# EAGLE design Magnetorquer Board (EAGLE 8.3.2)
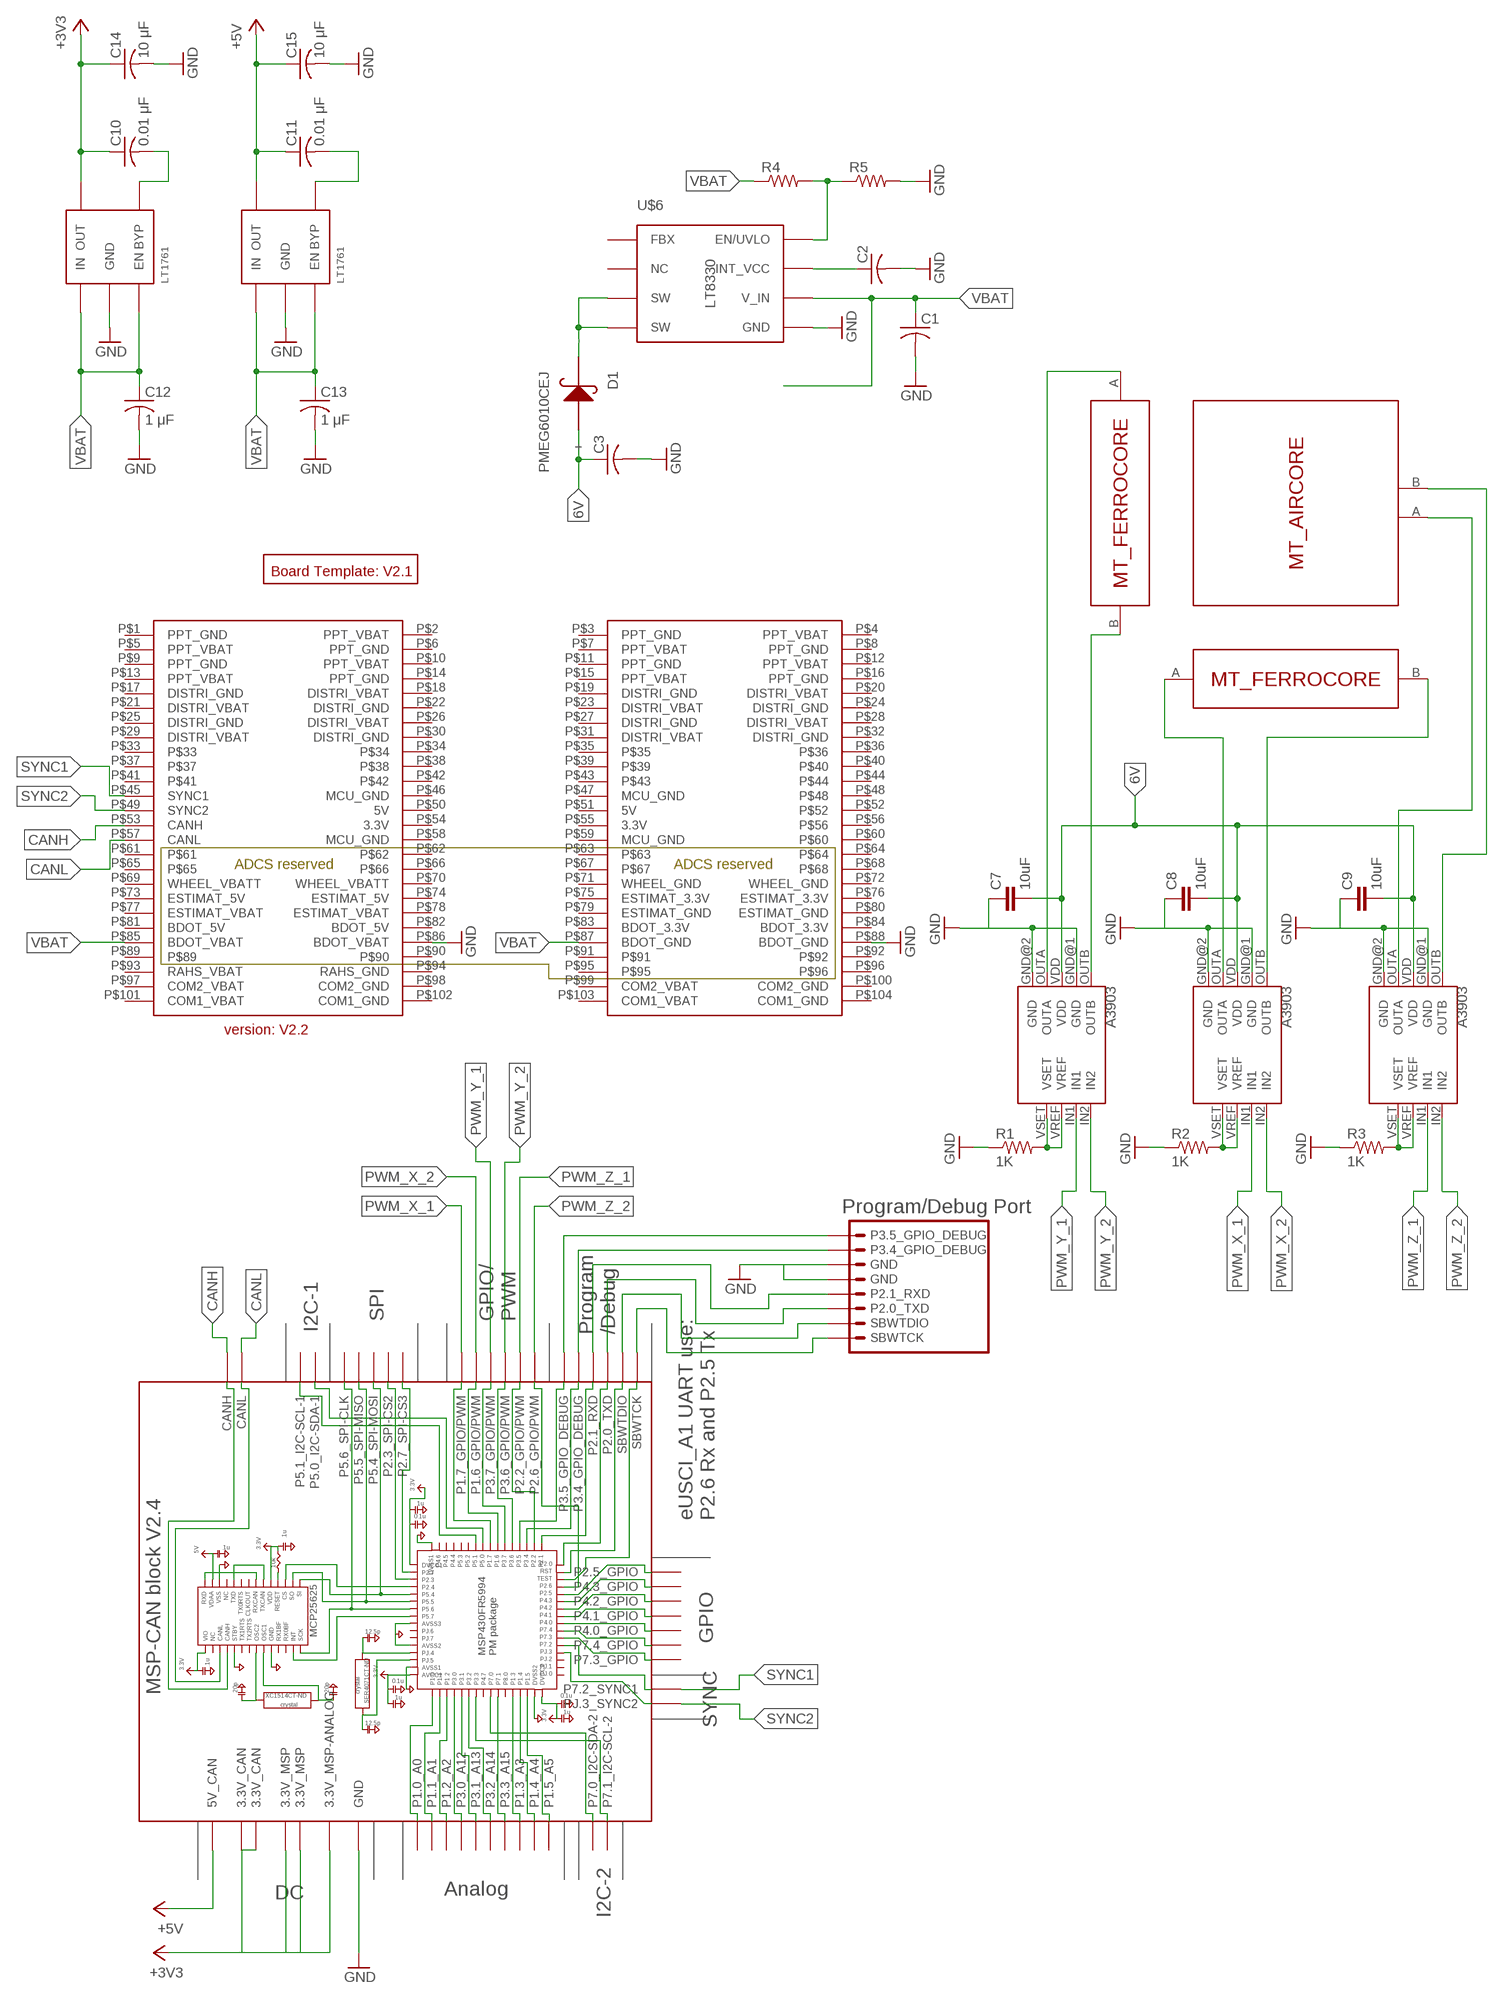
[diagram p0: schematic, sheet 1]

## Parts
C1  C-USC0805  [C0805]
C2  C-USC0805  [C0805]
C3  C-USC0805  [C0805]
C7  10uF  C-EUC0805  [C0805]
C8  10uF  C-EUC0805  [C0805]
C9  10uF  C-EUC0805  [C0805]
C10  0.01 μF  C-USC0805  [C0805]
C11  0.01 μF  C-USC0805  [C0805]
C12  1 μF  C-USC0805  [C0805]
C13  1 μF  C-USC0805  [C0805]
C14  10 μF  C-USC0805  [C0805]
C15  10 μF  C-USC0805  [C0805]
D1  PMEG6010CEJ  [SC-90]
LDO_3V3  LINEAR_LDO_LT1761-X  [SOT-23-5]
LDO_5V  LINEAR_LDO_LT1761-X  [SOT-23-5]
R1  1K  R-US_R0603  [R0603]
R2  1K  R-US_R0603  [R0603]
R3  1K  R-US_R0603  [R0603]
R4  R-US_R0805  [R0805]
R5  R-US_R0805  [R0805]
U1  A3903  [DFN-8EE]
U2  A3903  [DFN-8EE]
U3  A3903  [DFN-8EE]
U$1  PC104_CONNECTOR  [PC104_CONNECTOR]
U$2  BOARD_TEMPLATE  [BOARD_TEMPLATE]
U$3  MT_AIRCORE  [MT_AIRCORE]
U$4  MT_FERROCORE  [MT_FERROCORE]
U$5  MT_FERROCORE  [MT_FERROCORE]
U$6  LT8330  [DDB]
U$7  MSP-CAN_BLOCK  [MSP-CAN_BLOCK]
U$8  PROGRAM/DEBUG_PORT  [1X08_CONNECTOR]

## Nets
6V: C3.1 C7.2 C8.2 C9.2 D1.P$1(+) U1.VDD U2.VDD U3.VDD
+3V3: C10.1 C14.1 LDO_3V3.P$5(OUT) U$7.3.3V@CAN1(3.3V_CAN) U$7.3.3V@CAN2(3.3V_CAN) U$7.3.3V@MSP1(3.3V_MSP) U$7.3.3V@MSP2(3.3V_MSP) U$7.3.3V_ANALOG@MSP2(3.3V_MSP-ANALOG)
+5V: C11.1 C15.1 LDO_5V.P$5(OUT) U$7.5V(5V_CAN)
CANH: U$1.P$53(CANH) U$7.CANH
CANL: U$1.P$57(CANL) U$7.CANL
GND: C1.2 C2.2 C3.2 C7.1 C8.1 C9.1 C12.2 C13.2 C14.2 C15.2 LDO_3V3.P$2(GND) LDO_5V.P$2(GND) R1.1 R2.1 R3.1 R5.2 U1.GND@1(GND) U1.GND@2(GND) U2.GND@1(GND) U2.GND@2(GND) U3.GND@1(GND) U3.GND@2(GND) U$1.P$86(BDOT_VBAT) U$1.P$88(BDOT_GND) U$6.GND U$6.P$5(GND) U$7.GND@1(GND) U$7.GND@2(GND) U$7.GND@3(GND) U$7.GND@4(GND) U$7.GND@5(GND) U$7.GND@7(GND) U$7.GND@8(GND) U$7.GND@9(GND) U$7.GND@10(GND) U$7.GND@11(GND) U$7.GND@12(GND) U$7.GND@13(GND) U$7.GND@14(GND) U$7.GND@15(GND) U$7.GND@16(GND) U$7.GND@17(GND) U$7.GND@26(GND) U$8.5(GND) U$8.6(GND)
N$1: R1.2 U1.VREF U1.VSET
N$2: R2.2 U2.VREF U2.VSET
N$3: D1.P$2(-) U$6.P$3(SW) U$6.P$4(SW)
N$4: C2.1 U$6.P$7(INT_VCC)
N$5: R4.2 R5.1 U$6.P$8(EN/UVLO)
N$7: R3.2 U3.VREF U3.VSET
N$10: U1.OUTB U$4.B
N$11: U1.OUTA U$4.A
N$12: U2.OUTA U$5.A
N$13: U2.OUTB U$5.B
N$14: U3.OUTB U$3.B
N$15: U3.OUTA U$3.A
N$26: C10.2 LDO_3V3.P$4(BYP)
N$27: U$7.SBWTCK U$8.SBWTCK
N$28: U$7.SBWTDIO U$8.2(SBWTDIO)
N$29: U$7.P2.0_TXD U$8.3(P2.0_TXD)
N$30: U$7.P2.1_RXD U$8.4(P2.1_RXD)
N$31: U$7.P3.4_GPIO_DEBUG U$8.7(P3.4_GPIO_DEBUG)
N$32: U$7.P3.5_GPIO_DEBUG U$8.8(P3.5_GPIO_DEBUG)
N$33: C11.2 LDO_5V.P$4(BYP)
PWM_X_1: U2.IN1 U$7.P1.7_GPIO/PWM
PWM_X_2: U2.IN2 U$7.P1.6_GPIO/PWM
PWM_Y_1: U1.IN1 U$7.P3.7_GPIO/PWM
PWM_Y_2: U1.IN2 U$7.P3.6_GPIO/PWM
PWM_Z_1: U3.IN1 U$7.P2.2_GPIO/PWM
PWM_Z_2: U3.IN2 U$7.P2.6_GPIO/PWM
SYNC1: U$1.P$45(SYNC1) U$7.P7.2_SYNC1
SYNC2: U$1.P$49(SYNC2) U$7.PJ.3_SYNC2
VBAT: C1.1 C12.1 C13.1 LDO_3V3.P$1(IN) LDO_3V3.P$3(EN) LDO_5V.P$1(IN) LDO_5V.P$3(EN) R4.1 U$1.P$85(BDOT_VBAT) U$1.P$87(BDOT_GND) U$6.P$6(V_IN)
Unconnected: U$1.P$1(PPT_GND) U$1.P$2(PPT_VBAT) U$1.P$3(PPT_GND) U$1.P$4(PPT_VBAT) U$1.P$5(PPT_VBAT) U$1.P$6(PPT_GND) U$1.P$7(PPT_VBAT) U$1.P$8(PPT_GND) U$1.P$9(PPT_GND) U$1.P$10(PPT_VBAT) U$1.P$11(PPT_GND) U$1.P$12(PPT_VBAT) U$1.P$13(PPT_VBAT) U$1.P$14(PPT_GND) U$1.P$15(PPT_VBAT) U$1.P$16(PPT_GND) U$1.P$17(DISTRI_GND) U$1.P$18(DISTRI_VBAT) U$1.P$19(DISTRI_GND) U$1.P$20(DISTRI_VBAT) U$1.P$21(DISTRI_VBAT) U$1.P$22(DISTRI_GND) U$1.P$23(DISTRI_VBAT) U$1.P$24(DISTRI_GND) U$1.P$25(DISTRI_GND) U$1.P$26(DISTRI_VBAT) U$1.P$27(DISTRI_GND) U$1.P$28(DISTRI_VBAT) U$1.P$29(DISTRI_VBAT) U$1.P$30(DISTRI_GND) U$1.P$31(DISTRI_VBAT) U$1.P$32(DISTRI_GND) U$1.P$33 U$1.P$34 U$1.P$35 U$1.P$36 U$1.P$37 U$1.P$38 U$1.P$39 U$1.P$40 U$1.P$41 U$1.P$42 U$1.P$43 U$1.P$44 U$1.P$46(MCU_GND) U$1.P$47(MCU_GND) U$1.P$48 U$1.P$50(5V) U$1.P$51(5V) U$1.P$52 U$1.P$54(3.3V) U$1.P$55(3.3V) U$1.P$56 U$1.P$58(MCU_GND) U$1.P$59(MCU_GND) U$1.P$60 U$1.P$61 U$1.P$62 U$1.P$63 U$1.P$64 U$1.P$65 U$1.P$66 U$1.P$67 U$1.P$68 U$1.P$69(WHEEL_VBATT) U$1.P$70(WHEEL_VBATT) U$1.P$71(WHEEL_GND) U$1.P$72(WHEEL_GND) U$1.P$73(ESTIMAT_5V) U$1.P$74(ESTIMAT_5V) U$1.P$75(ESTIMAT_3.3V) U$1.P$76(ESTIMAT_3.3V) U$1.P$77(ESTIMAT_VBAT) U$1.P$78(ESTIMAT_VBAT) U$1.P$79(ESTIMAT_GND) U$1.P$80(ESTIMAT_GND) U$1.P$81(BDOT_5V) U$1.P$82(BDOT_5V) U$1.P$83(BDOT_3.3V) U$1.P$84(BDOT_3.3V) U$1.P$89 U$1.P$90 U$1.P$91 U$1.P$92 U$1.P$93(RAHS_VBAT) U$1.P$94(RAHS_GND) U$1.P$95 U$1.P$96 U$1.P$97(COM2_VBAT) U$1.P$98(COM2_GND) U$1.P$99(COM2_VBAT) U$1.P$100(COM2_GND) U$1.P$101(COM1_VBAT) U$1.P$102(COM1_GND) U$1.P$103(COM1_VBAT) U$1.P$104(COM1_GND) U$6.P$1(FBX) U$6.P$2(NC) U$7.P1.0_A0 U$7.P1.1_A1 U$7.P1.2_A2 U$7.P1.3_A3 U$7.P1.4_A4 U$7.P1.5_A5 U$7.P2.4_SPI-CS2(P2.3_SPI-CS2) U$7.P2.5_GPIO U$7.P2.7_SPI-CS3 U$7.P3.0_A12 U$7.P3.1_A13 U$7.P3.2_A14 U$7.P3.3_A15 U$7.P4.0_GPIO U$7.P4.1_GPIO U$7.P4.2_GPIO U$7.P4.3_GPIO U$7.P5.0_I2C-SDA-1 U$7.P5.1_I2C-SCL-1 U$7.P5.4_SPI-MOSI U$7.P5.5_SPI-MISO U$7.P5.6_SPI-CLK U$7.P7.0_I2C-SDA-2 U$7.P7.1_I2C-SCL-2 U$7.P7.3_GPIO U$7.P7.4_GPIO

## Library data of the parts
C1-C3 C10-C15 = rcl:C-US: CAPACITOR, American symbol
C7-C9 = rcl:C-EU: CAPACITOR, European symbol
D1 = DubSat1 Components:PMEG6010CEJ
LDO_3V3 LDO_5V = DubSat1 Components:LINEAR_LDO_LT1761-X
R1-R5 = rcl:R-US_: RESISTOR, American symbol
U1-U3 = DubSat1 Components:A3903: Allegro MicroSystems A3903 H-bridge Technical Specifications: Supply voltage: 3-5.5V Operating temperature: -40°C to 85°C Output current: 500mA Digikey: 620-1205-1-ND
U$1 = DubSat1 Components:PC104_CONNECTOR
U$2 = DubSat1 Components:BOARD_TEMPLATE
U$3 = DubSat1 Components:MT_AIRCORE
U$4 U$5 = DubSat1 Components:MT_FERROCORE
U$6 = DubSat1 Components:LT8330
U$7 = DubSat1 Components:MSP-CAN_BLOCK
U$8 = DubSat1 Components:PROGRAM/DEBUG_PORT

## Net classes
0 default: width 0.254 mm, drill 0.254 mm, clearance 0.152 mm

## Board
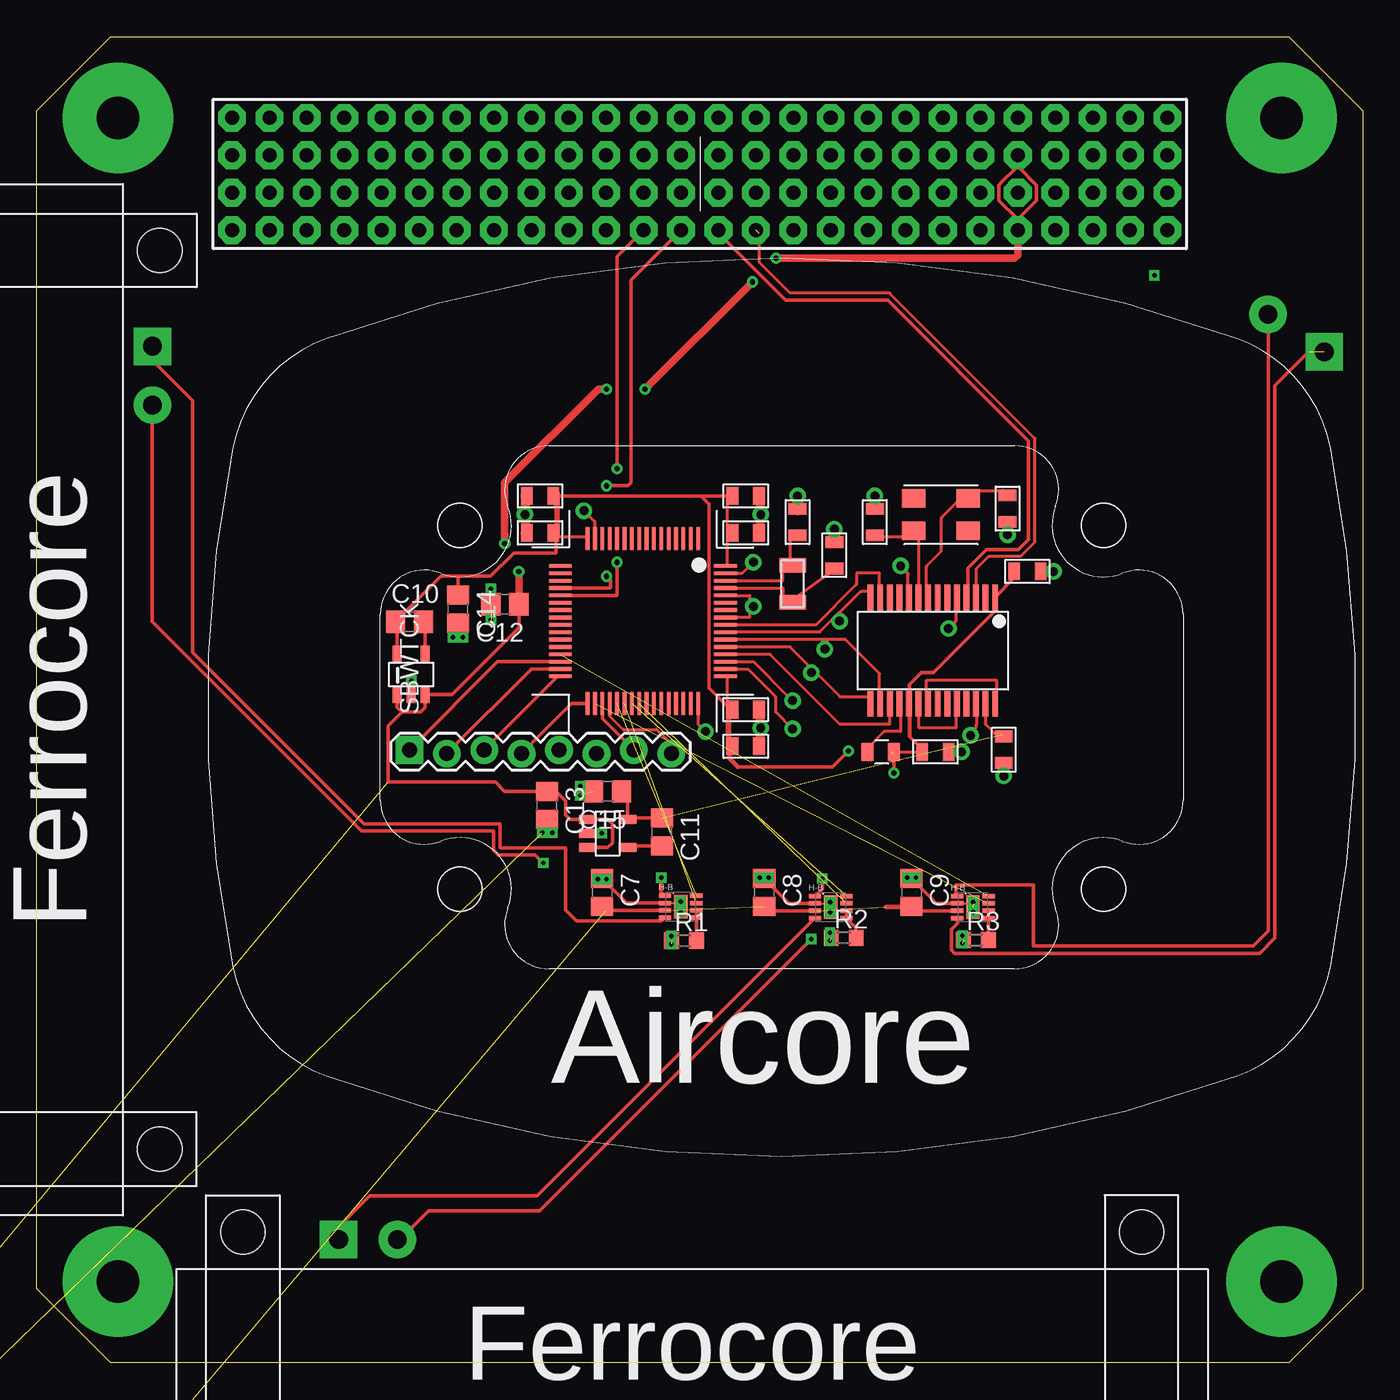
[diagram p1: board, top side]
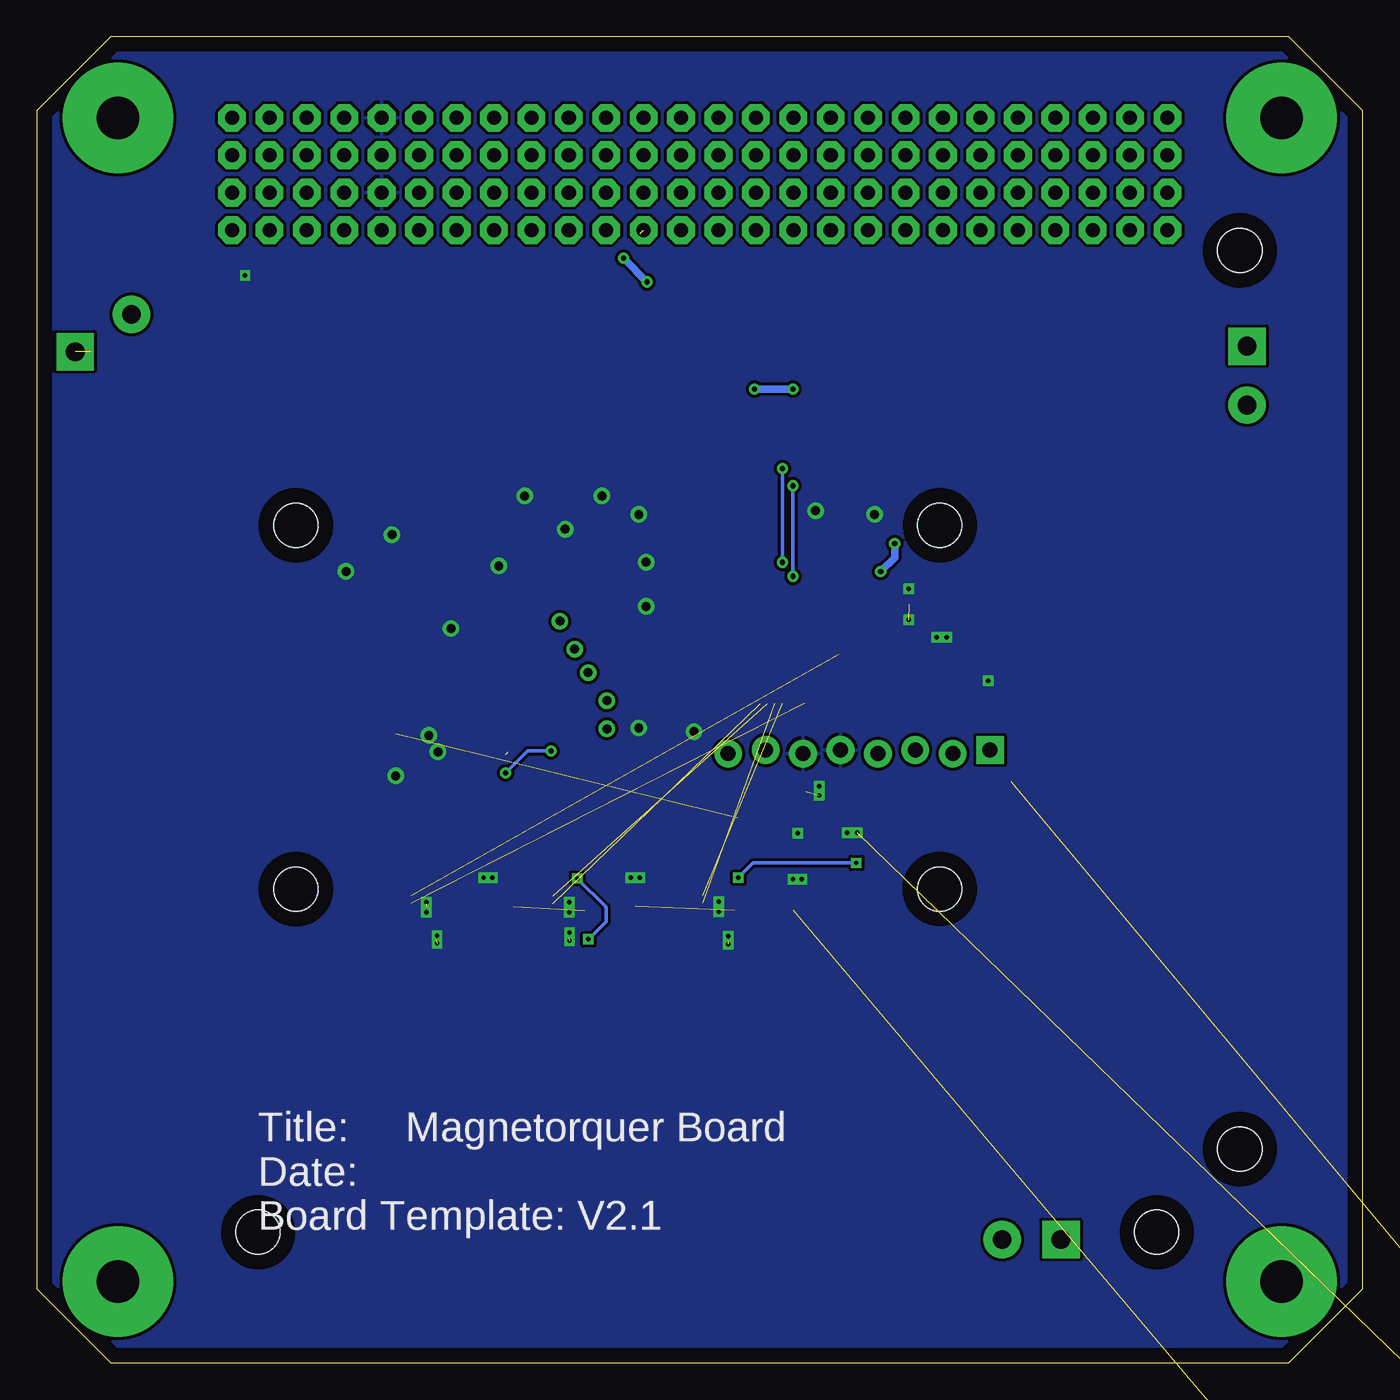
[diagram p2: board, bottom side, seen from below]

Size 90 x 90 mm. Coordinates in mm from the lower left corner, seen from the top.
Copper layers (1*16): Top 0.035mm / dielectric 1.5mm / Bottom 0.035mm
Design rules "default *": minimum track width 8mil, minimum drill 0.4mm, track to track 8mil, track to pad 8mil, pad to pad 8mil, via to via 8mil, smd to smd 8mil, copper to edge 40mil, drill to drill 6mil, minimum pad ring 10mil, minimum via ring 8mil, stop-mask expansion 4mil, vias tented up to drill 0mil, thermal gap 10mil

### Footprints (pad centres in the part's own frame; a part is rotated, then mirrored left to right if it is on the bottom)
C0805 = smd 1.3 x 1.5: 1 -0.95,0; 2 0.95,0
SC-90 = smd 0.5 x 0.5: P$1 -1.05,0; P$2 1.05,0
SOT-23-5 = smd 0.6 x 1.2: P$1 -0.95,-1.35; P$2 0,-1.35; P$3 0.95,-1.35; P$4 0.95,1.35; P$5 -0.95,1.35
R0603 = smd 1 x 1.1: 1 -0.85,0; 2 0.85,0
R0805 = smd 1.3 x 1.5: 1 -0.95,0; 2 0.95,0
DFN-8EE = smd 0.83 x 0.3: GND@1 -1.065,0.25; IN1 1.065,0.25; IN2 1.065,0.75; OUTA -1.065,-0.75; OUTB -1.065,0.75; VDD -1.065,-0.25; VREF 1.065,-0.25; VSET 1.065,-0.75 | smd 0.9 x 1.6: GND@2 0,0
PC104_CONNECTOR = drill 0.953 pad 1.88 octagon: P$1 -31.75,31.88; P$2 -31.75,34.42; P$3 -31.75,36.96; P$4 -31.75,39.5; P$5 -29.21,31.88; P$6 -29.21,34.42; P$7 -29.21,36.96; P$8 -29.21,39.5; P$9 -26.67,31.88; P$10 -26.67,34.42; P$11 -26.67,36.96; P$12 -26.67,39.5; P$13 -24.13,31.88; P$14 -24.13,34.42; P$15 -24.13,36.96; P$16 -24.13,39.5; P$17 -21.59,31.88; P$18 -21.59,34.42; P$19 -21.59,36.96; P$20 -21.59,39.5; P$21 -19.05,31.88; P$22 -19.05,34.42; P$23 -19.05,36.96; P$24 -19.05,39.5; P$25 -16.51,31.88; P$26 -16.51,34.42; P$27 -16.51,36.96; P$28 -16.51,39.5; P$29 -13.97,31.88; P$30 -13.97,34.42; P$31 -13.97,36.96; P$32 -13.97,39.5; P$33 -11.43,31.88; P$34 -11.43,34.42; P$35 -11.43,36.96; P$36 -11.43,39.5; P$37 -8.89,31.88; P$38 -8.89,34.42; P$39 -8.89,36.96; P$40 -8.89,39.5; P$41 -6.35,31.88; P$42 -6.35,34.42; P$43 -6.35,36.96; P$44 -6.35,39.5; P$45 -3.81,31.88; P$46 -3.81,34.42; P$47 -3.81,36.96; P$48 -3.81,39.5; P$49 -1.27,31.88; P$50 -1.27,34.42; P$51 -1.27,36.96; P$52 -1.27,39.5; P$53 1.27,31.88; P$54 1.27,34.42; P$55 1.27,36.96; P$56 1.27,39.5; P$57 3.81,31.88; P$58 3.81,34.42; P$59 3.81,36.96; P$60 3.81,39.5; P$61 6.35,31.88; P$62 6.35,34.42; P$63 6.35,36.96; P$64 6.35,39.5; P$65 8.89,31.88; P$66 8.89,34.42; P$67 8.89,36.96; P$68 8.89,39.5; P$69 11.43,31.88; P$70 11.43,34.42; P$71 11.43,36.96; P$72 11.43,39.5; P$73 13.97,31.88; P$74 13.97,34.42; P$75 13.97,36.96; P$76 13.97,39.5; P$77 16.51,31.88; P$78 16.51,34.42; P$79 16.51,36.96; P$80 16.51,39.5; P$81 19.05,31.88; P$82 19.05,34.42; P$83 19.05,36.96; P$84 19.05,39.5; P$85 21.59,31.88; P$86 21.59,34.42; P$87 21.59,36.96; P$88 21.59,39.5; P$89 24.13,31.88; P$90 24.13,34.42; P$91 24.13,36.96; P$92 24.13,39.5; P$93 26.67,31.88; P$94 26.67,34.42; P$95 26.67,36.96; P$96 26.67,39.5; P$97 29.21,31.88; P$98 29.21,34.42; P$99 29.21,36.96; P$100 29.21,39.5; P$101 31.75,31.88; P$102 31.75,34.42; P$103 31.75,36.96; P$104 31.75,39.5
BOARD_TEMPLATE = drill 2.9 pad 7.5: P$1 -39.5,39.5; P$2 -39.5,-39.5; P$3 39.5,-39.5; P$4 39.5,39.5
MT_AIRCORE = drill 1.27 pad 2.54 square: A -36.83,-24.13 | drill 1.27 pad 2.54: B -33.02,-26.67 | hole 3: -21.849,12.352; 21.849,12.344; 21.857,-12.347; -21.849,-12.352
MT_FERROCORE = drill 1.27 pad 2.54 square: A 7,24 | drill 1.27 pad 2.54: B 7,20 | hole 3: 7.5,30.5; 7.5,-30.5
DDB = smd 0.61 x 2.2: GND 0,0 | smd 0.7 x 0.25: P$1 -0.925,0.75; P$2 -0.925,0.25; P$3 -0.925,-0.25; P$4 -0.925,-0.75; P$5 0.925,-0.75; P$6 0.925,-0.25; P$7 0.925,0.25; P$8 0.925,0.75
MSP-CAN_BLOCK = smd 1.2 x 0.8: 1 -6,6.08; 2 -6,7.88; 3 -8.5,6.08; 4 -8.5,7.88; 9 -8.5,-6.08; 10 -8.5,-7.88; 11 -6,-6.08; 12 -6,-7.88; 13 8.5,6.08; 14 8.5,7.88; 15 6,6.08; 16 6,7.88; 23 8.875,18.955; 24 8.875,20.755; 25 8.875,17.045; 26 8.875,15.245; 27 -3.375,25.205; 28 -3.375,27.005 | smd 1 x 0.25: 3.3V@CAN1 -3.375,25.125; 3.3V@CAN2 8.875,18.875; 3.3V@MSP1 8.501,5.884; 3.3V@MSP2 -8.533,-5.962; 3.3V_ANALOG@MSP2 -8.482,5.904 | smd 0.8 x 1.2: 5 -5.83,10.5; 6 -7.63,10.5; 7 -3.58,13; 8 -5.38,13; 17 -8.545,24.75; 18 -6.745,24.75; 19 -5.83,15.75; 20 -7.63,15.75; 21 7.83,24.5; 22 9.63,24.5 | smd 0.25 x 1: 5V 7.65,24.5 | smd 1.75 x 0.4: CANH -1.6,21.96; CANL -1.6,22.61; P$65 -1.6,23.91; P$66 -1.6,23.26; P$69 -1.6,21.31; P$70 -1.6,20.66; P$71 -1.6,20.01; P$72 -1.6,19.36; P$73 -1.6,18.71; P$74 -1.6,18.06; P$75 -1.6,17.41; P$76 -1.6,16.76; P$77 -1.6,16.11; P$78 -1.6,15.46; P$79 5.6,15.46; P$80 5.6,16.11; P$81 5.6,16.76; P$82 5.6,17.41; P$83 5.6,18.06; P$84 5.6,18.71; P$85 5.6,19.36; P$86 5.6,20.01; P$87 5.6,20.66; P$88 5.6,21.31; P$89 5.6,21.96; P$90 5.6,22.61; P$91 5.6,23.26; P$92 5.6,23.91 | drill 0.61: GND@1 -3.375,27.875; GND@2 -5.875,24.75; GND@3 -3.75,17.5; GND@4 0.5,20.75; GND@5 -8.5,15.75; GND@7 -8.5,10.5; GND@8 -7.25,8; GND@9 -4,7.5; GND@10 -1,7.5; GND@11 7.75,22.25; GND@12 10.5,24.5; GND@13 8.875,21.625; GND@14 7.25,8; GND@15 7.5,4.25; GND@16 -7.5,-4; GND@17 -7.25,-8; GND@26 -6.25,13; P2.4_SPI-CS2 5.397,10.16; P2.7_SPI-CS3 7.303,10.16; P5.4_SPI-MOSI 3.487,11.434; P5.5_SPI-MISO 1.9,12.354; P5.6_SPI-CLK 0,13.348 | smd 1.55 x 0.25: P1.0_A0 -5.6,3.75; P1.1_A1 -5.6,3.25; P1.2_A2 -5.6,2.75; P1.3_A3 -5.6,-1.75; P1.4_A4 -5.6,-2.25; P1.5_A5 -5.6,-2.75; P1.6_GPIO/PWM 5.6,-0.75; P1.7_GPIO/PWM 5.6,-0.25; P2.1_RXD 5.6,-3.75; P2.2_GPIO/PWM 5.6,-3.25; P3.0_A12 -5.6,2.25; P3.1_A13 -5.6,1.75; P3.2_A14 -5.6,1.25; P3.3_A15 -5.6,0.75; P3.4_GPIO_DEBUG 5.6,-2.75; P3.5_GPIO_DEBUG 5.6,-2.25; P3.6_GPIO/PWM 5.6,-1.75; P3.7_GPIO/PWM 5.6,-1.25; P5.0_I2C-SDA-1 5.6,0.25; P5.1_I2C-SCL-1 5.6,0.75; P7.0_I2C-SDA-2 -5.6,-0.25; P7.1_I2C-SCL-2 -5.6,-0.75; P$8 -5.6,0.25; P$11 -5.6,-1.25; P$15 -5.6,-3.25; P$16 -5.6,-3.75; P$43 5.6,1.25; P$44 5.6,1.75; P$45 5.6,2.25; P$46 5.6,2.75; P$47 5.6,3.25; P$48 5.6,3.75 | smd 0.25 x 1.55: P2.0_TXD 3.75,-5.6; P2.5_GPIO 1.75,-5.6; P2.6_GPIO/PWM 2.25,-5.6; P4.0_GPIO -0.25,-5.6; P4.1_GPIO 0.25,-5.6; P4.2_GPIO 0.75,-5.6; P4.3_GPIO 1.25,-5.6; P7.2_SYNC1 -1.75,-5.6; P7.3_GPIO -1.25,-5.6; P7.4_GPIO -0.75,-5.6; P$17 -3.75,-5.6; P$18 -3.25,-5.6; P$19 -2.75,-5.6; P$49 3.75,5.6; P$50 3.25,5.6; P$51 2.75,5.6; P$52 2.25,5.6; P$53 1.75,5.6; P$54 1.25,5.6; P$55 0.75,5.6; P$56 0.25,5.6; P$57 -0.25,5.6; P$58 -0.75,5.6; P$59 -1.25,5.6; P$60 -1.75,5.6; P$61 -2.25,5.6; P$62 -2.75,5.6; P$63 -3.25,5.6; P$64 -3.75,5.6; PJ.3_SYNC2 -2.25,-5.6; SBWTCK 2.75,-5.6; SBWTDIO 3.25,-5.6 | smd 1 x 1.8: P$93 -3.79,10.16; P$94 -1.29,10.16 | smd 1.25 x 1.6: P$104 -6.13,18.38; P$105 -6.13,22.08; P$106 -8.33,22.08; P$107 -8.33,18.38
1X08_CONNECTOR = drill 1.016 pad 1.88: 2 2.54,-0.127; 3 5.08,0.127; 4 7.62,-0.127; 5 10.16,0.127; 6 12.7,-0.127; 7 15.24,0.127; 8 17.78,-0.127 | drill 1.016 pad 1.88 square: SBWTCK 0,0.127

### Placement (x,y rotation side)
C1  -34.27,-35.2 0 top  (outside the outline)
C2  -34.27,-40.92 0 top  (outside the outline)
C3  -34.27,-61.55 0 top  (outside the outline)
C7  38.37,31.92 270 top
C8  49.37,31.92 270 top
C9  59.37,31.92 270 top
C10  25.31,50.3 0 top
C11  42.43,36.02 270 top
C12  31.77,51.48 180 top
C13  34.62,37.82 270 top
C14  28.59,51.16 270 top
C15  38.75,38.78 180 top
D1  -34.27,-56.79 0 top  (outside the outline)
LDO_3V3  25.42,46.71 0 top
LDO_5V  38.75,35.92 270 top
R1  43.93,28.64 0 top
R2  54.77,28.84 0 top
R3  63.75,28.69 0 top
R4  -34.27,-46.63 0 top  (outside the outline)
R5  -34.27,-52.35 0 top  (outside the outline)
U1  43.7,30.95 0 top
U2  53.89,30.93 0 top
U3  63.54,30.93 0 top
U$1  45,45 0 top
U$2  45,45 0 top
U$3  50.56,44.49 180 top
U$4  0.84,45 0 top
U$5  44.48,1.36 90 top
U$6  -34.27,-28.85 0 top  (outside the outline)
U$7  41.14,50.33 270 top
U$8  25.29,41.47 0 top

### Tracks (layer width: path | path; a pad name or v marks a point on that pad's centre or on a via)
6V  (4 unrouted)
  Top 0.254: C8.2 49.67,30.68 U2.VDD | C9.2 59.67,30.68 U3.VDD | C7.2 38.64,30.7 U1.VDD
  Top 0.305: C9.2 59.42,30.92 57.64,30.92
+3V3  (via drill 0.35)  (1 unrouted)
  Top 0.254: U$7.3.3V@CAN1 66.26,53.18 65.07,51.98 65.07,51.04 60.87,46.85 60.04,46.85 59.22,46.04 59.22,45.15 | 59.25,45.13 59.22,45.15 | 59.22,45.15 59.22,42.51 60.01,41.72 U$7.3.3V@CAN2 | 35.23,58.82 U$7.3.3V@MSP2 | 45.1,58.82 35.23,58.82 | 45.1,58.82 U$7.3.3V_ANALOG@MSP2 | 47.59,40.45 54.02,40.45 v55.08,41.52 | v58.18,40.02 58.18,41.29 | U$7.3.3V@MSP1 47.02,44.4 45.63,45.79 45.63,58.28 45.1,58.82 | LDO_3V3.P$5 24.47,50.19 C10.1 27.45,53.38 28.59,53.38 | 28.59,53.38 30.81,53.38 32.4,54.97 35.26,54.97 35.26,58.14 35.23,58.18 35.23,58.82 | C14.1 28.59,53.38
  Top 0.305: U$7.3.3V@MSP1 47.02,41.02 47.59,40.45
  Bottom 0.254: v55.08,41.52 56.68,41.52 v58.18,40.02
+5V  (1 unrouted)
  Top 0.254: C11.1 40.2,36.97 LDO_5V.P$5 40.1,38.38 C15.1
CANH
  Top 0.254: U$1.P$53 46.27,76.66 50.82,72.11 57.76,72.11 67.31,62.57 67.31,55.94 67.33,55.92 67.33,55.9 66.61,55.18 64.45,55.18 63.22,53.96 63.22,52.05 U$7.CANH
CANL  (1 unrouted)
  Top 0.203: U$7.CANL 63.77,51.95 63.77,53.9 64.63,54.75 66.79,54.75 67.76,55.72 67.76,62.73 57.88,72.61 51.11,72.61 49.06,74.66 49.06,76.63
GND  (via drill 0.3)  (12 unrouted)
  Top 0.152: U1.GND@1 43.61,31.2 v43.7,31.3 U1.GND@2 v43.7,30.6 | U2.GND@1 53.77,31.18 v53.86,31.27 | U3.GND@1 63.47,31.18 63.5,31.21 | 63.5,31.21 v63.57,31.27 | v53.86,30.57 53.86,30.9 U2.GND@2 | v63.57,30.57 63.57,31.14 63.5,31.21
  Top 0.254: C8.1 51.07,31.18 U2.GND@1 | C9.1 61.07,31.18 U3.GND@1 | U1.GND@1 40.04,31.2 C7.1 | v25.42,46.29 LDO_3V3.P$2 | 34.62,36.32 34.62,36.28 v34.31,35.96 | C13.2 34.62,36.32 | 34.62,36.32 v34.98,35.96 | LDO_5V.P$2 38.33,35.92 v38.36,35.95 | v28.25,49.25 28.25,49.87 28.43,50.05 | 28.43,50.05 C14.2 | v28.92,49.25 28.92,49.56 28.43,50.05
  other vias: 75.86,73.8 38.07,32.82 38.67,32.82 49.07,32.92 49.67,32.92 59.07,32.92 59.67,32.92 43.07,28.95 43.07,28.41 53.84,29.2 53.84,28.64 62.83,29 62.83,28.46 36.88,39.14 36.88,38.5 30.83,52.53 30.83,50.42
  pour Bottom: -0.24,89.7 89.68,89.7 89.68,0.3 89.17,-0.21 -0.24,-0.21 -0.24,89.2
N$1
  Top 0.254: U1.VREF U1.VSET R1.2
N$2
  Top 0.254: U2.VREF U2.VSET 55.62,29.51 R2.2
N$3  (2 unrouted)
N$4  (1 unrouted)
N$5  (2 unrouted)
N$7
  Top 0.254: U3.VREF U3.VSET 64.6,30.17 R3.2
N$10  (via drill 0.3)
  Top 0.254: U1.OUTB 42.37,31.97 v42.37,32.92 | v34.37,33.92 33.83,34.47 31.77,34.47 | 31.77,34.47 31.72,34.47 | U$4.B 7.84,50.29 22.04,36.1 30.99,36.1 30.99,34.78 31.3,34.47 31.77,34.47
  Bottom 0.254: v42.37,32.92 41.37,33.92 v34.37,33.92
N$11
  Top 0.254: U1.OUTA 42.6,30.2 42.39,29.99 36.62,29.99 35.89,30.72 35.89,34.92 31.49,34.92 31.45,34.97 31.45,36.55 22.23,36.55 10.59,48.2 10.59,65.31 7.84,68.06 U$4.A
N$12
  Top 0.254: U$5.A 20.48,9.21 22.59,11.31 33.96,11.31 U2.OUTA
N$13  (via drill 0.3)
  Top 0.254: U2.OUTB 53.32,32.17 v53.32,32.87 | U$5.B 24.48,7.42 24.59,7.31 24.59,8.31 26.59,10.31 34.13,10.31 v52.56,28.74
  Bottom 0.254: v53.32,32.87 51.37,30.92 51.37,29.92 v52.56,28.74
N$14
  Top 0.254: U3.OUTB 62.37,31.78 62.37,32.43 67.64,32.43 67.64,28.3 82.57,28.3 83.58,29.31 U$3.B
N$15  (1 unrouted)
  Top 0.254: 62.57,30.18 U3.OUTA 62.48,29.82 62.07,29.41 62.07,28.01 62.29,27.78 65.1,27.78 | 86.35,68.62 84.04,66.31 84.04,28.82 83,27.78 65.1,27.78 | 65.2,27.78 65.1,27.78
N$24  (1 unrouted)
  Top 0.254: 58.03,41.44 58,41.44 | 58.06,41.32 58.06,41.37
N$26
  Top 0.254: LDO_3V3.P$4 26.37,50.19 C10.2
N$27
  Top 0.254: U$8.SBWTCK 31.28,47.58 U$7.SBWTCK
N$28
  Top 0.254: U$8.2 33.57,47.08 U$7.SBWTDIO
N$29
  Top 0.254: U$8.3 35.36,46.58 U$7.P2.0_TXD
N$30
  Top 0.254: U$8.4 36.3,44.73 U$7.P2.1_RXD
N$31
  Top 0.254: U$8.7 38.39,43.74 U$7.P3.4_GPIO_DEBUG
N$32
  Top 0.203: U$7.P3.5_GPIO_DEBUG 38.88,43.91 39.79,42.99 42.08,42.99 43.07,42 U$8.8
N$33
  Top 0.254: LDO_5V.P$4 40.2,35.07 C11.2
PWM_X_1  (1 unrouted)
PWM_X_2  (1 unrouted)
PWM_Y_1  (1 unrouted)
PWM_Y_2  (1 unrouted)
PWM_Z_1  (1 unrouted)
PWM_Z_2  (1 unrouted)
SYNC1  (via drill 0.35)
  Top 0.254: U$7.P7.2_SYNC1 39.36,52.08 39.39,52.11 v39.39,54.34 | v39.39,60.68 39.39,75.08 U$1.P$45
  Bottom 0.254: v39.39,54.34 v39.39,60.68
SYNC2  (via drill 0.35)
  Top 0.254: U$7.PJ.3_SYNC2 38.91,52.58 38.93,52.61 38.93,53.13 v38.68,53.38 | v38.68,59.52 40.13,59.52 40.34,59.73 40.34,73.49 U$1.P$49
  Bottom 0.254: v38.68,53.38 v38.68,59.52
VBAT  (via drill 0.35)  (3 unrouted)
  Top 0.254: LDO_3V3.P$1 24.47,44.49 24.78,44.17 | 24.78,44.17 26.05,44.17 26.37,44.49 LDO_3V3.P$3 28.19,45.36 32.72,49.89 C12.1 | 34.94,38.46 C13.1 | 24.78,44.17 23.83,43.22 23.83,39.41 31.13,39.41 31.77,38.78 C13.1 | LDO_5V.P$3 38.75,34.97 39.07,35.28 39.07,36.55 38.75,36.87 LDO_5V.P$1 36.21,36.87 35.89,37.19 35.89,38.14 35.26,38.77 C13.1 | 66.59,77.62 U$1.P$85 66.59,77.61 65.32,78.88 65.32,79.95 65.42,80.05 66.59,81.22 U$1.P$87 66.59,81.22 67.86,79.95 67.86,78.89 66.59,77.62
  Top 0.508: U$1.P$85 66.59,75.19 66.37,74.97 v50.18,74.97 | v48.57,73.36 v41.29,66.08 | v38.68,66.08 38.12,66.08 31.77,59.73 v31.77,55.6 | v32.72,53.7 C12.1
  Bottom 0.508: v50.18,74.97 v48.57,73.36 | v41.29,66.08 v38.68,66.08 | v31.77,55.6 31.77,54.65 v32.72,53.7